# Altium project ESP32T.PrjPcb
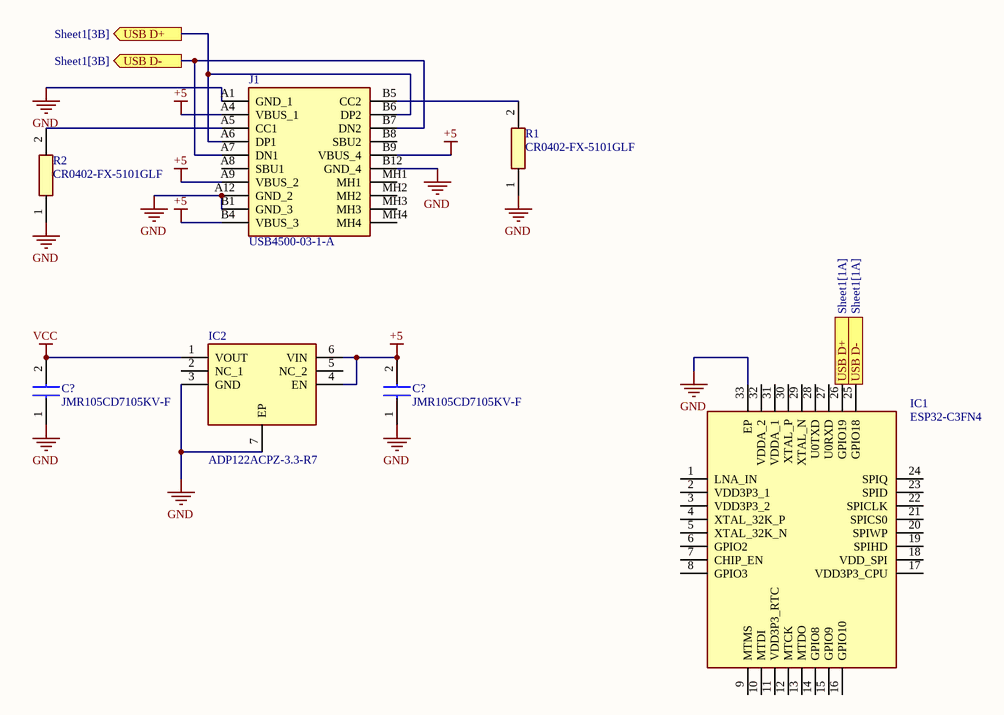
[diagram p0: Sheet1.SchDoc]
1 sheet, 7 parts. Net scope: flat (ports and power ports of the same name join across sheets).
Board file: PCB1.PcbDoc

## Sheet Sheet1.SchDoc
size A4; SheetNumber: 1; SheetTotal: 1

### Parts
(Parts that share a designator on the sheet are numbered #1, #2 ... from top to bottom, then left to right.)
C?#1  JMR105CD7105KV-F  [CAPC1106X70N]
C?#2  JMR105CD7105KV-F  [CAPC1106X70N]
IC1  ESP32-C3FN4  [QFN50P500X500X90-33N-D]
IC2  ADP122ACPZ-3.3-R7  [SON65P200X200X60-7N-D]
J1  USB4500-03-1-A  [USB4500031A]
R1  CR0402-FX-5101GLF  [RESC1005X40N]
R2  CR0402-FX-5101GLF  [RESC1005X40N]

### Ports
USB D+ (in, see Sheet1[1A]), USB D+ (out, see Sheet1[3B]), USB D- (in, see Sheet1[1A]), USB D- (out, see Sheet1[3B])

### Nets
+5: C?#2.2 IC2.4(EN) IC2.6(VIN) J1.A4(VBUS_1) J1.A9(VBUS_2) J1.B4(VBUS_3) J1.B9(VBUS_4)
GND: C?#1.1 C?#2.1 IC1.33(EP) IC2.3(GND) IC2.7(EP) J1.A1(GND_1) J1.A12(GND_2) J1.B1(GND_3) J1.B12(GND_4) R1.1 R2.1
VCC: C?#1.2 IC2.1(VOUT)
NetIC1_25: IC1.25(GPIO18) J1.A7(DN1) J1.B7(DN2) ; port USB D-
NetIC1_26: IC1.26(GPIO19) J1.A6(DP1) J1.B6(DP2) ; port USB D+
NetJ1_A5: J1.A5(CC1) R2.2
NetJ1_B5: J1.B5(CC2) R1.2

Not connected (* = marked no-connect by the designer): IC1 1(LNA_IN) 2(VDD3P3_1) 3(VDD3P3_2) 4(XTAL_32K_P) 5(XTAL_32K_N) 6(GPIO2) 7(CHIP_EN) 8(GPIO3) 9(MTMS) 10(MTDI) 11(VDD3P3_RTC) 12(MTCK) 13(MTDO) 14(GPIO8) 15(GPIO9) 16(GPIO10) 17(VDD3P3_CPU) 18(VDD_SPI) 19(SPIHD) 20(SPIWP) 21(SPICS0) 22(SPICLK) 23(SPID) 24(SPIQ) 27(U0RXD) 28(U0TXD) 29(XTAL_N) 30(XTAL_P) 31(VDDA_1) 32(VDDA_2); IC2 2(NC_1) 5(NC_2); J1 A8(SBU1) B8(SBU2) MH1 MH2 MH3 MH4

### Library data of the parts
C?#1 C?#2 = JMR105CD7105KV-F: Capacitor; Manufacturer_Name: TAIYO YUDEN; Datasheet Link: https://ds.yuden.co.jp/TYCOMPAS/or/specSheet?pn=MAASJ105CD7105KFCA01; Height: 0.7mm; Manufacturer_Part_Number: JMR105CD7105KV-F; Mouser Part Number: 963-JMR105CD7105KV-F; Mouser Price/Stock: https://www.mouser.co.uk/ProductDetail/Taiyo-Yuden/JMR105CD7105KV-F?qs=DPoM0jnrROVuxy8ekm8jxA%3D%3D
IC1 = ESP32-C3FN4: Integrated Circuit; Manufacturer_Name: Espressif Systems; Datasheet Link: https://www.mouser.co.uk/datasheet/2/891/esp32_c3_datasheet_en-1989865.pdf; Height: 0.9mm; Manufacturer_Part_Number: ESP32-C3FN4; Mouser Part Number: 356-ESP32-C3FN4; Mouser Price/Stock: https://www.mouser.co.uk/ProductDetail/Espressif-Systems/ESP32-C3FN4?qs=iLbezkQI%252BsjnhgSmJXMnMQ%3D%3D
IC2 = ADP122ACPZ-3.3-R7: Integrated Circuit; Manufacturer_Name: Analog Devices; Datasheet Link: http://www.analog.com/media/en/technical-documentation/data-sheets/ADP122_123.pdf; Height: 0.6mm; Manufacturer_Part_Number: ADP122ACPZ-3.3-R7; Mouser Part Number: 584-ADP122ACPZ-3.3R7; Mouser Price/Stock: https://www.mouser.co.uk/ProductDetail/Analog-Devices/ADP122ACPZ-33-R7?qs=BpaRKvA4VqFGxcUJVezYbA%3D%3D; Arrow Part Number: ADP122ACPZ-3.3-R7; Arrow Price/Stock: https://www.arrow.com/en/products/adp122acpz-3.3-r7/analog-devices
J1 = USB4500-03-1-A: Connector; Manufacturer_Name: GCT (GLOBAL CONNECTOR TECHNOLOGY); Datasheet Link: https://pl.mouser.com/datasheet/2/837/usb4500-2583670.pdf; Height: 3.36mm; Manufacturer_Part_Number: USB4500-03-1-A; Mouser Part Number: 640-USB4500031A; Mouser Price/Stock: https://www.mouser.co.uk/ProductDetail/GCT/USB4500-03-1-A?qs=7D1LtPJG0i0Bl4gt1pUZZw%3D%3D
R1 R2 = CR0402-FX-5101GLF: Resistor; Manufacturer_Name: Bourns; Datasheet Link: https://www.bourns.com/pdfs/CR0402.pdf; Height: 0.4mm; Manufacturer_Part_Number: CR0402-FX-5101GLF; Mouser Part Number: 652-CR0402FX-5101GLF; Mouser Price/Stock: https://www.mouser.co.uk/ProductDetail/Bourns/CR0402-FX-5101GLF?qs=ePR1ZvdkOKImkuXR%2F%2FtvtA%3D%3D